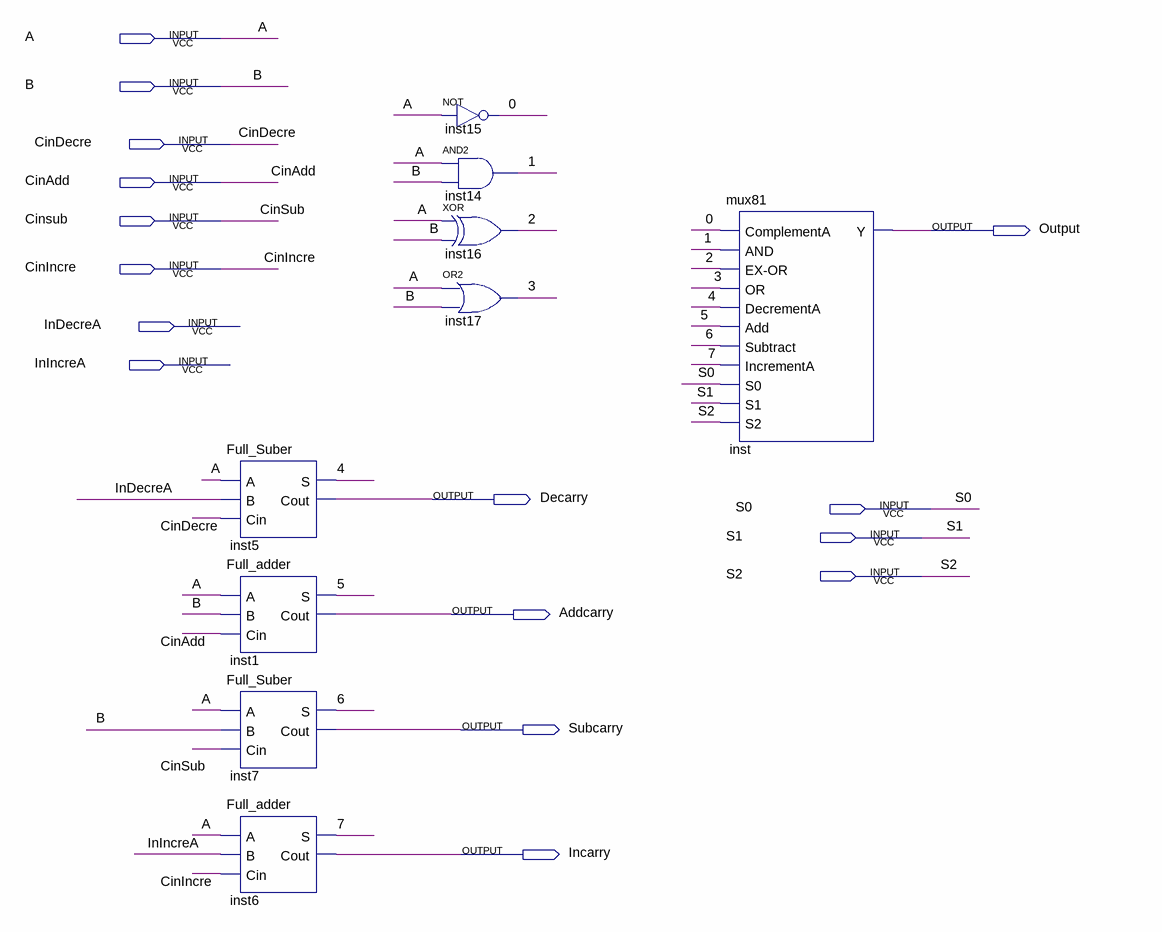
[diagram p0: schematic sheet]
// Quartus schematic ALU1bit.bdf as structural Verilog: 9 symbols, 16 pins
module ALU1bit (
  input  A,
  input  B,
  input  CinDecre,
  input  CinAdd,
  input  Cinsub,
  input  CinIncre,
  input  InDecreA,
  input  InIncreA,
  input  S0,
  input  S1,
  input  S2,
  output Output,
  output Decarry,
  output Addcarry,
  output Subcarry,
  output Incarry
);

  wire \0 , \1 , \2 , \3 , \4 , \5 , \6 , \7 ;

  Full_Suber inst5 (.A(A), .B(InDecreA), .Cin(CinDecre), .S(\4 ), .Cout(Decarry));
  Full_adder inst1 (.A(A), .B(B), .Cin(CinAdd), .S(\5 ), .Cout(Addcarry));
  Full_Suber inst7 (.A(A), .B(B), .Cin(Cinsub), .S(\6 ), .Cout(Subcarry));
  Full_adder inst6 (.A(A), .B(InIncreA), .Cin(CinIncre), .S(\7 ), .Cout(Incarry));
  not inst15 (\0 , A);
  and inst14 (\1 , A, B);
  xor inst16 (\2 , A, B);
  or inst17 (\3 , A, B);
  mux81 inst (
    .ComplementA(\0 ), .AND(\1 ), .\EX-OR (\2 ), .OR(\3 ), .DecrementA(\4 ), .Add(\5 ), .Subtract(\6 ),
    .IncrementA(\7 ), .S0(S0), .S1(S1), .S2(S2), .Y(Output));
endmodule
